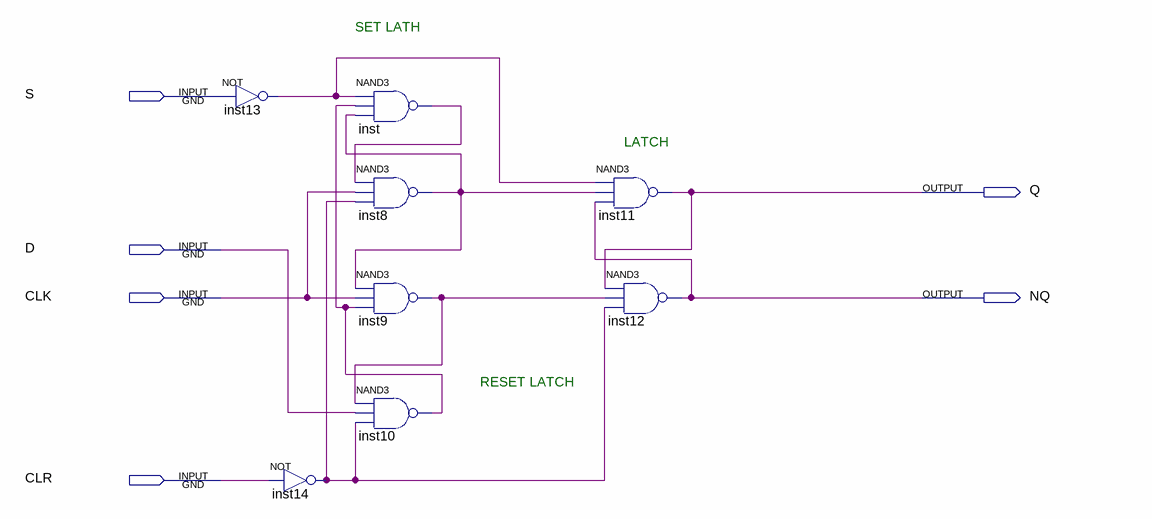
[diagram p0: schematic sheet]
// Quartus schematic Edge_Tri_D_FlipFlop.bdf as structural Verilog: 8 symbols, 6 pins
module Edge_Tri_D_FlipFlop (
  input  S,
  input  D,
  input  CLK,
  input  CLR,
  output Q,
  output NQ
);

  wire inst8_out, inst9_out, inst10_out, inst13_out, inst14_out, inst_out;

  not inst13 (inst13_out, S);
  not inst14 (inst14_out, CLR);
  nand inst (inst_out, inst13_out, inst10_out, inst8_out);
  nand inst8 (inst8_out, inst_out, CLK, inst14_out);
  nand inst9 (inst9_out, inst8_out, CLK, inst10_out);
  nand inst10 (inst10_out, inst9_out, D, inst14_out);
  nand inst11 (Q, inst13_out, inst8_out, NQ);
  nand inst12 (NQ, Q, inst9_out, inst14_out);

  // Notes on the sheet:
  //   SET LATH
  //   LATCH
  //   RESET LATCH
endmodule
